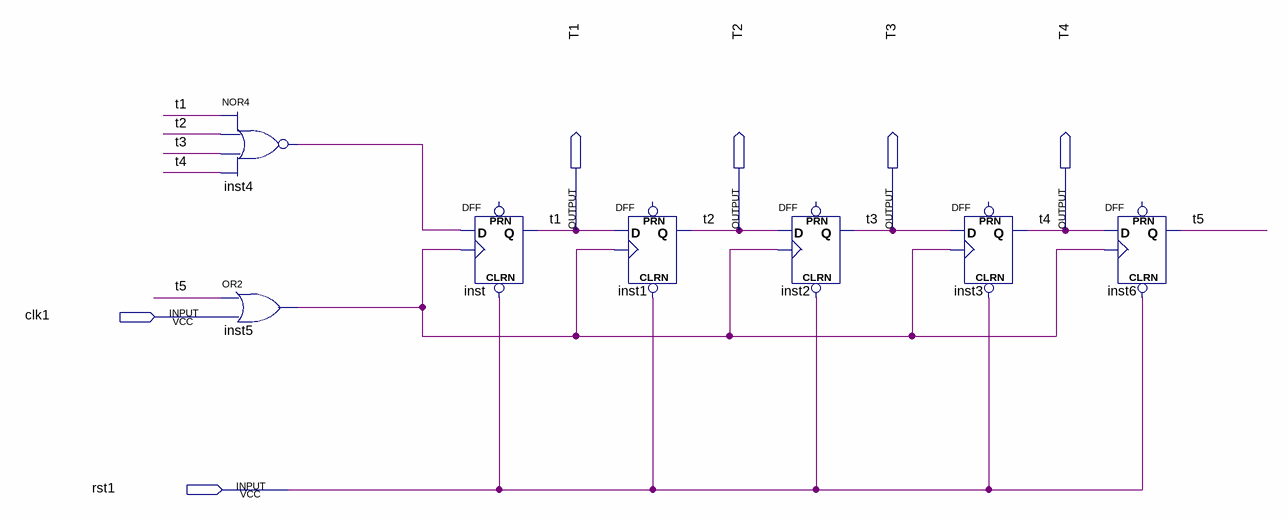
[diagram p0: schematic sheet]
// Quartus schematic exp112.bdf as structural Verilog: 7 symbols, 6 pins
module exp112 (
  input  clk1,
  input  rst1,
  output T1,
  output T2,
  output T3,
  output T4
);

  wire inst4_out, inst5_out, t5;

  nor inst4 (inst4_out, T1, T2, T3, T4);
  or inst5 (inst5_out, t5, clk1);
  DFF inst (.CLRN(rst1), .CLK(inst5_out), .D(inst4_out), .Q(T1));  // open: PRN
  DFF inst1 (.CLRN(rst1), .CLK(inst5_out), .D(T1), .Q(T2));  // open: PRN
  DFF inst2 (.CLRN(rst1), .CLK(inst5_out), .D(T2), .Q(T3));  // open: PRN
  DFF inst3 (.CLRN(rst1), .CLK(inst5_out), .D(T3), .Q(T4));  // open: PRN
  DFF inst6 (.CLRN(rst1), .CLK(inst5_out), .D(T4), .Q(t5));  // open: PRN
endmodule
